# Altium schematic sheet Control.SchDoc: Control
size Letter; Date: 1/14/2018; DrawnBy: Logan Horowitz; DocumentNumber: 5; Revision: 1.1; DocumentName: Control
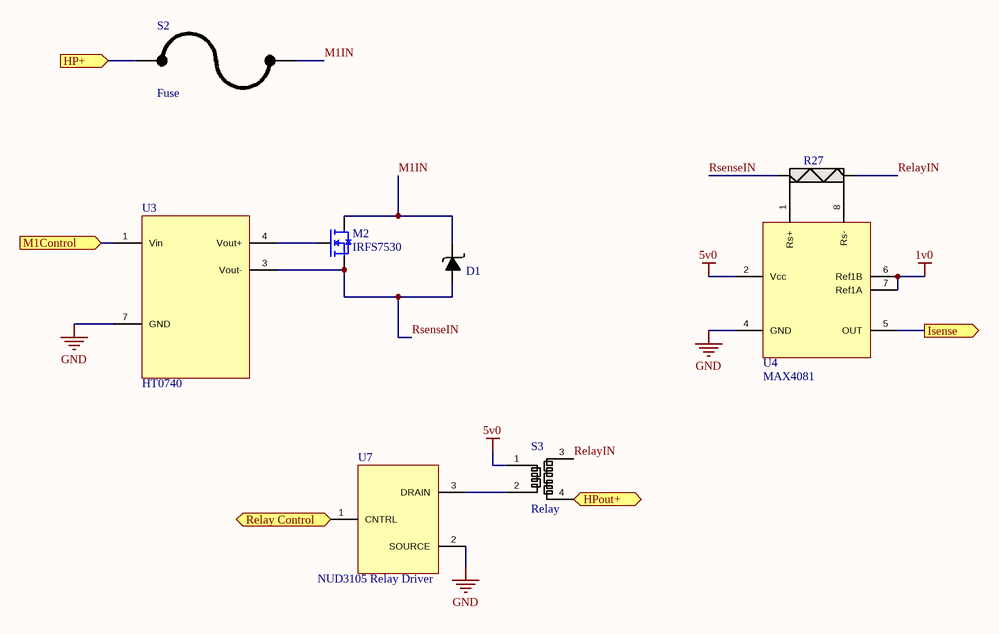
[diagram p0: Control.SchDoc]

## Parts
D1  OR Diode  [POWERDI 5]  (value not drawn)
M2  IRFS7530  [D2PAK-7]
R27  Isense Resistor  [SenseResistor]  (value not drawn)
S2  Fuse  [Fuse Holder]
S3  Relay  [JT-N Relay]
U3  HT0740  [SOIC8]
U4  MAX4081  [SOIC8]
U7  NUD3105 Relay Driver  [SOT23]

## Ports
HP+ (in), HPout+ (out), Isense (out), M1Control (in), Relay Control (in)

## Nets
1v0: U4.6(Ref1B) U4.7(Ref1A)
5v0: S3.1(coil1) U4.2(Vcc)
GND: U3.7(GND) U4.4(GND) U7.2(SOURCE)
HP+: S2.1 ; port HP+
HPout+: S3.4(OUT2) ; port HPout+
Isense: U4.5(OUT) ; port Isense
M1Control: U3.1(Vin) ; port M1Control
M1IN: D1.2 M2.D S2.2
Relay Control: U7.1(CNTRL) ; port Relay Control
RelayIN: R27.2(OUT) S3.3(OUT1)
RsenseIN: D1.1 M2.S R27.1(IN) U3.3(Vout-)
NetM2_G: M2.G U3.4(Vout+)
NetR27_3: R27.3(senseHI) U4.1(Rs+)
NetR27_4: R27.4(senseLOW) U4.8(Rs-)
NetS3_2: S3.2(coil2) U7.3(DRAIN)

## Library data of the parts
M2 = IRFS7530: IRFS7530 Power MOSFET